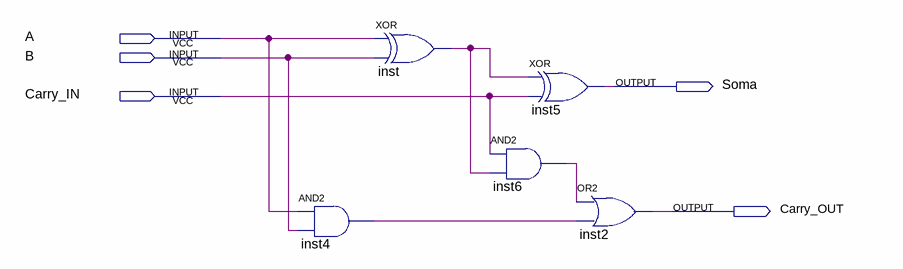
[diagram p0: schematic sheet]
// Quartus schematic FullAdder.bdf as structural Verilog: 5 symbols, 5 pins
module FullAdder (
  input  A,
  input  B,
  input  Carry_IN,
  output Soma,
  output Carry_OUT
);

  wire inst4_out, inst6_out, inst_out;

  and inst4 (inst4_out, A, B);
  xor inst (inst_out, A, B);
  xor inst5 (Soma, inst_out, Carry_IN);
  and inst6 (inst6_out, Carry_IN, inst_out);
  or inst2 (Carry_OUT, inst6_out, inst4_out);
endmodule
